# Altium schematic sheet LDO_LD.SchDoc
size A4; SPICEModelCacheCRXGBNIE: <root> / <DocumentId>CRXGBNIE</DocumentId> / <CacheFrame Number="0"> / <Model Name="2510_74438323010_1u" Kind="CKT"> / <Text>******* / .subckt 2510_74438323010_1u 1 2 / Rp 1 2 2155.33 / Cp 1 2 3.992p / Rs 1 N3 0.063 / L1 N3 2 1.01u / .ends 2510_74438323010_1u</Text> / </Model> / </CacheFrame> / </root>
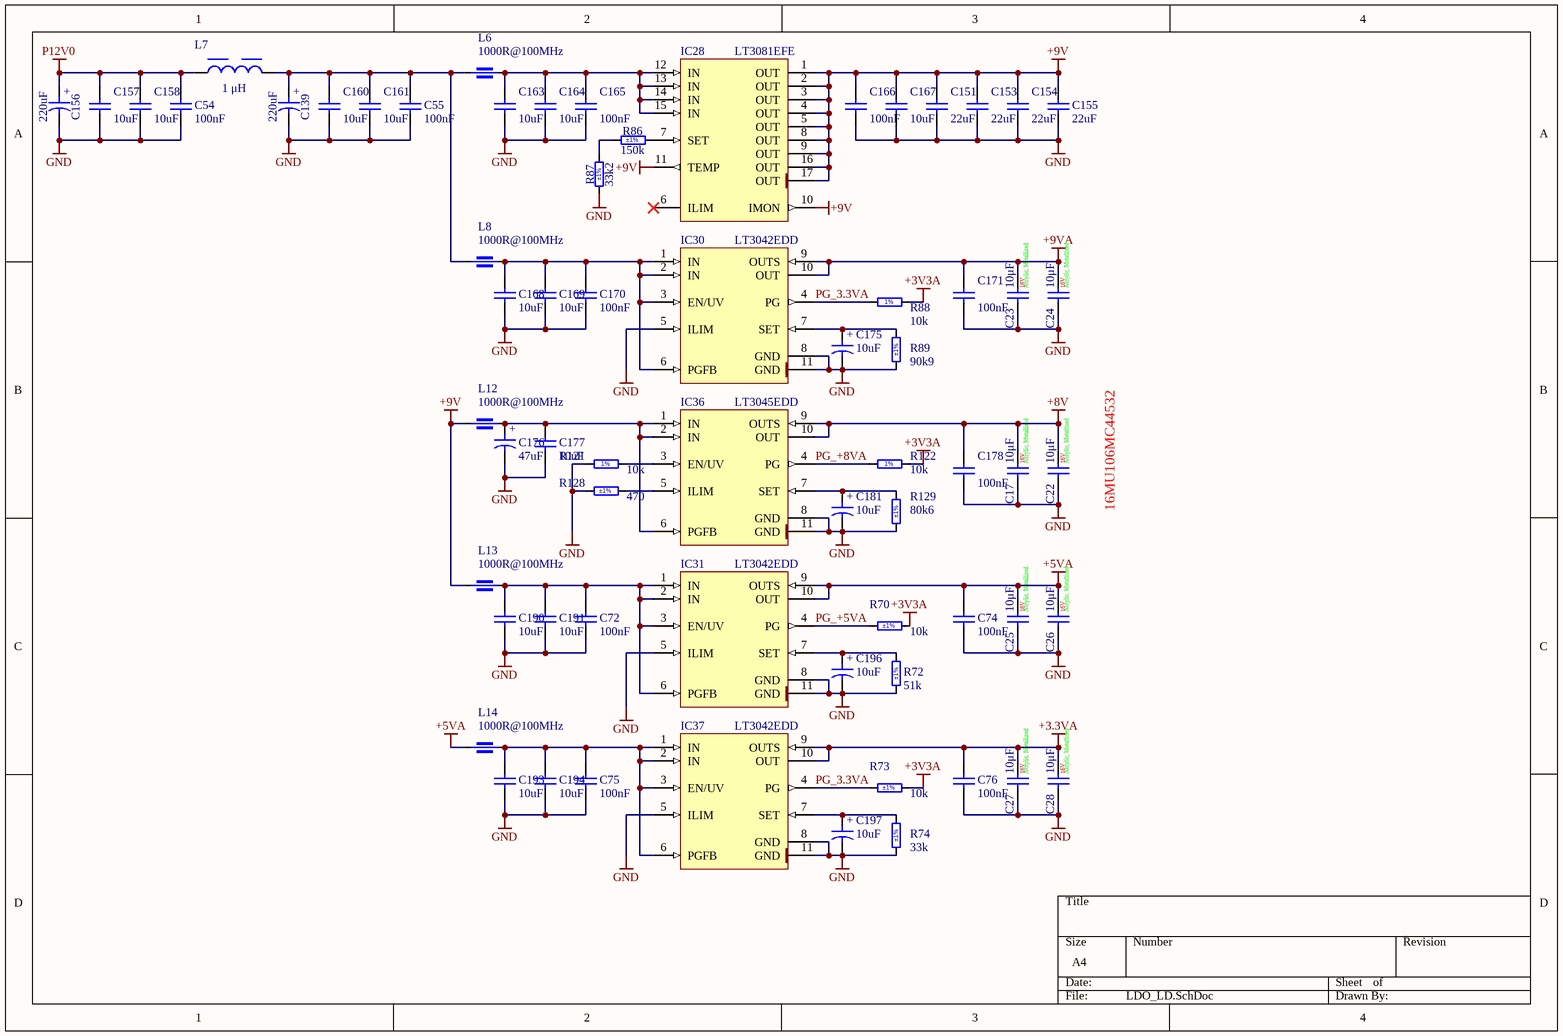
[diagram p0: LDO_LD.SchDoc]

## Parts
C17  DielectrikType: Acrylic, Metallized  Value1: 10μF  Value2: 16V  [16MU106MC44532]  (hidden comment: 16MU106MC44532)
C22  DielectrikType: Acrylic, Metallized  Value1: 10μF  Value2: 16V  [16MU106MC44532]  (hidden comment: 16MU106MC44532)
C23  DielectrikType: Acrylic, Metallized  Value1: 10μF  Value2: 16V  [16MU106MC44532]  (hidden comment: 16MU106MC44532)
C24  DielectrikType: Acrylic, Metallized  Value1: 10μF  Value2: 16V  [16MU106MC44532]  (hidden comment: 16MU106MC44532)
C25  DielectrikType: Acrylic, Metallized  Value1: 10μF  Value2: 16V  [16MU106MC44532]  (hidden comment: 16MU106MC44532)
C26  DielectrikType: Acrylic, Metallized  Value1: 10μF  Value2: 16V  [16MU106MC44532]  (hidden comment: 16MU106MC44532)
C27  DielectrikType: Acrylic, Metallized  Value1: 10μF  Value2: 16V  [16MU106MC44532]  (hidden comment: 16MU106MC44532)
C28  DielectrikType: Acrylic, Metallized  Value1: 10μF  Value2: 16V  [16MU106MC44532]  (hidden comment: 16MU106MC44532)
C54  100nF  [CAPC1005X55N]
C55  100nF  [CAPC1005X55N]
C72  100nF  [CAPC1005X55N]
C74  100nF  [CAPC1005X55N]
C75  100nF  [CAPC1005X55N]
C76  100nF  [CAPC1005X55N]
C139  220uF  [CAPMP7343X430N]
C151  22uF  [CAPC3216X180N]
C153  22uF  [CAPC3216X180N]
C154  22uF  [CAPC3216X180N]
C155  22uF  [CAPC3216X180N]
C156  220uF  [CAPMP7343X430N]
C157  10uF  [CAPC2012X145N]
C158  10uF  [CAPC2012X145N]
C160  10uF  [CAPC2012X145N]
C161  10uF  [CAPC2012X145N]
C163  10uF  [CAPC2012X145N]
C164  10uF  [CAPC2012X145N]
C165  100nF  [CAPC1005X55N]
C166  100nF  [CAPC1005X55N]
C167  10uF  [CAPC2012X145N]
C168  10uF  [CAPC2012X145N]
C169  10uF  [CAPC2012X145N]
C170  100nF  [CAPC1005X55N]
C171  100nF  [CAPC1005X55N]
C175  10uF  [CAPMP6032X280N]
C176  47uF  [CAPMP6032X280N]
C177  10uF  [CAPC2012X145N]
C178  100nF  [CAPC1005X55N]
C181  10uF  [CAPMP6032X280N]
C190  10uF  [CAPC2012X145N]
C191  10uF  [CAPC2012X145N]
C193  10uF  [CAPC2012X145N]
C194  10uF  [CAPC2012X145N]
C196  10uF  [CAPMP6032X280N]
C197  10uF  [CAPMP6032X280N]
IC28  LT3081EFE  [SOP65P640X110-17N-R294X358]
IC30  LT3042EDD  [SON50P300X300X80-11N-R175X248]
IC31  LT3042EDD  [SON50P300X300X80-11N-R175X248]
IC36  LT3045EDD  [SON50P300X300X80-11N-R175X248]
IC37  LT3042EDD  [SON50P300X300X80-11N-R175X248]
L6  1000R@100MHz  [INDC1608X95N]
L7  1 μH  [WE-MAPI_2510]
L8  1000R@100MHz  [INDC1608X95N]
L12  1000R@100MHz  [INDC1608X95N]
L13  1000R@100MHz  [INDC1608X95N]
L14  1000R@100MHz  [INDC1608X95N]
R70  10k  Tolerance: ±1%  [RESC1005X40N]
R72  51k  Tolerance: ±1%  [RESC1005X40N]
R73  10k  Tolerance: ±1%  [RESC1005X40N]
R74  33k  Tolerance: ±1%  [RESC1005X40N]
R86  150k  Tolerance: ±1%  [RESC1608X55N]
R87  33k2  Tolerance: ±1%  [RESC1608X55N]
R88  10k  [RESC1005X40N]
R89  90k9  Tolerance: ±1%  [RESC1608X55N]
R121  10k  [RESC1005X40N]
R122  10k  [RESC1005X40N]
R128  470  Tolerance: ±1%  [RESC1608X55N]
R129  80k6  Tolerance: ±1%  [RESC1608X55N]

## Nets
+3.3VA: C27.2 C28.2 C76.1 IC37.9(OUTS) IC37.10(OUT)
+3V3A: R70.2 R73.2 R88.2 R122.2
+5VA: C25.2 C26.2 C74.1 IC31.9(OUTS) IC31.10(OUT) L14.1
+8V: C17.2 C22.2 C178.1 IC36.9(OUTS) IC36.10(OUT)
+9V: C151.2 C153.2 C154.2 C155.2 C166.1 C167.2 IC28.1(OUT) IC28.2(OUT) IC28.3(OUT) IC28.4(OUT) IC28.5(OUT) IC28.8(OUT) IC28.9(OUT) IC28.10(IMON) IC28.11(TEMP) IC28.16(OUT) IC28.17(OUT) L12.1 L13.1
+9VA: C23.2 C24.2 C171.1 IC30.9(OUTS) IC30.10(OUT)
GND: C17.1 C22.1 C23.1 C24.1 C25.1 C26.1 C27.1 C28.1 C54.2 C55.2 C72.2 C74.2 C75.2 C76.2 C139.2 C151.1 C153.1 C154.1 C155.1 C156.2 C157.1 C158.1 C160.1 C161.1 C163.1 C164.1 C165.2 C166.2 C167.1 C168.1 C169.1 C170.2 C171.2 C175.2 C176.2 C177.1 C178.2 C181.2 C190.1 C191.1 C193.1 C194.1 C196.2 C197.2 IC30.5(ILIM) IC30.8(GND) IC30.11(GND) IC31.5(ILIM) IC31.8(GND) IC31.11(GND) IC36.8(GND) IC36.11(GND) IC37.5(ILIM) IC37.8(GND) IC37.11(GND) R72.1 R74.1 R87.1 R89.1 R121.1 R128.1 R129.1
P12V0: C54.1 C156.1 C157.2 C158.2 L7.1
PG_3.3VA: IC30.4(PG) IC37.4(PG) R73.1 R88.1
PG_+5VA: IC31.4(PG) R70.1
PG_+8VA: IC36.4(PG) R122.1
NetC55_1: C55.1 C139.1 C160.2 C161.2 L6.1 L7.2 L8.1
NetC72_1: C72.1 C190.2 C191.2 IC31.1(IN) IC31.2(IN) IC31.3(EN/UV) IC31.6(PGFB) L13.2
NetC75_1: C75.1 C193.2 C194.2 IC37.1(IN) IC37.2(IN) IC37.3(EN/UV) IC37.6(PGFB) L14.2
NetC163_2: C163.2 C164.2 C165.1 IC28.12(IN) IC28.13(IN) IC28.14(IN) IC28.15(IN) L6.2
NetC168_2: C168.2 C169.2 C170.1 IC30.1(IN) IC30.2(IN) IC30.3(EN/UV) IC30.6(PGFB) L8.2
NetC175_1: C175.1 IC30.7(SET) R89.2
NetC176_1: C176.1 C177.2 IC36.1(IN) IC36.2(IN) IC36.6(PGFB) L12.2
NetC181_1: C181.1 IC36.7(SET) R129.2
NetC196_1: C196.1 IC31.7(SET) R72.2
NetC197_1: C197.1 IC37.7(SET) R74.2
NetIC28_7: IC28.7(SET) R86.2
NetIC36_3: IC36.3(EN/UV) R121.2
NetIC36_5: IC36.5(ILIM) R128.2
NetR86_1: R86.1 R87.2

Not connected (* = marked no-connect by the designer): IC28 6(ILIM)*

## Notes on the sheet
- (near C22) 16MU106MC44532
- (in symbol CTE6032-28_10UF_25V_10%_LESR0500) +
- (in symbol CTE6032-28_47UF_16V_10%_LESR0350) +
- (in symbol CTE7343-43_220UF_16V_10%) +
- (in symbol R0402_10K_1%_0.0625W_100PPM) 1%

## Library data of the parts
C17 C22-C28 = 10uF/16V/1812/MET: 10 µF Film Capacitor 16V Acrylic, Metallized 1812 (4532 Metric); Manufacture: Rubycon; Shop1ID: 1189-2511-2-ND; DafaultFootprint: 1812; Assembly: SMD; Parameter1: Cap; Parameter2: Vr; Tolerance1: ±20%; Shop1: Digi-Key; ComponentLink1URL: https://www.rubycon.co.jp/wp-content/uploads/catalog-pmlcap/MU.pdf; ComponentLink2URL: *; ComponentLink1Description: Datasheet; ComponentLink2Description: *; ComponentType: Capacitor; ComponentSymbol: 16MU106MC44532; Parameter3: *; Tolerance2: *
C54 C55 C72 C74-C76 C165 C166 C170 C171 C178 = CC0402_100NF_16V_10%_X5R: Non-polarised capacitor; Part Description: SMD Multilayer Chip Ceramic Capacitor; Manufacturer: GENERIC; Manufacturer1 Part Number: GRM155R61C104KA88D; Voltage: 16V; TC: X5R; Tolerance: ±10%; Table: Capacitors SMD; Part Number: CC0402_100NF_16V_10%_X5R; Component Kind: Standard; Component Type: Standard; Pin Count: 2; Value: 100nF; Status: None; Manufacturer Part Number: CC0402_100NF_16V_10%_X5R; Case: 0402; Mounted: Yes; Socket: No; SMD: Yes; Manufacturer1 Example: MURATA; Manufacturer1 ComponentHeight: 0.55mm; HelpURL: \\cern.ch\dfs\Applications\Altium\Datasheets\CC0402_X5R_MURATA_GRM.pdf; Author: CERN DEM JLC; CreateDate: 2013-12-10; LatestRevisionDate: 2013-12-10
C139 C156 = CTE7343-43_220UF_16V_10%: Polarised capacitor; Part Description: Solid Tantalum Chip Capacitor; Manufacturer: GENERIC; Manufacturer1 Part Number: TAJE227K016R; Voltage: 16V; Tolerance: ±10%; Part Number: CTE7343-43_220UF_16V_10%; Component Kind: Standard; Component Type: Standard; Pin Count: 2; Value: 220uF; Status: Preferred; Manufacturer Part Number: CTE7343-43_220UF_16V_10%; Case: E; Mounted: Yes; Socket: No; SMD: Yes; Sense: No; Manufacturer1 Example: AVX; Manufacturer1 ComponentHeight: 4.3mm; HelpURL: \\cern.ch\dfs\Applications\Altium\Datasheets\CTE_AVX_TAJ.pdf; Author: CERN DEM JLC; CreateDate: 03.12.2007; LatestRevisionDate: 03.12.2007
C151 C153-C155 = CC1206_22UF_10V_10%_X7R: Non-polarised capacitor; Part Description: SMD Multilayer Chip Ceramic Capacitor; Manufacturer: GENERIC; Manufacturer1 Part Number: GRM31CR71A226KE15L; Voltage: 10V; TC: X7R; Tolerance: ±10%; Part Number: CC1206_22UF_10V_10%_X7R; Component Kind: Standard; Component Type: Standard; Pin Count: 2; Value: 22uF; Status: Preferred; Manufacturer Part Number: CC1206_22UF_10V_10%_X7R; Case: 1206; Mounted: Yes; Socket: No; SMD: Yes; Sense: No; Manufacturer1 Example: MURATA; Manufacturer1 ComponentHeight: 1.8mm; HelpURL: \\cern.ch\dfs\Applications\Altium\Datasheets\CC1206_X7R_MURATA_GRM-HI-CAP.pdf; Author: CERN DEM JLC; CreateDate: 08.06.2010; LatestRevisionDate: 08.06.2010
C157 C158 C160 C161 C163 C164 C167-C169 C177 C190 C191 C193 C194 = CC0805_10UF_25V_10%_X7R: Non-polarised capacitor; Part Description: SMD Multilayer Chip Ceramic Capacitor; Manufacturer: GENERIC; Manufacturer1 Part Number: GRM21BZ71E106KE15; Voltage: 25V; TC: X7R; Tolerance: ±10%; Part Number: CC0805_10UF_25V_10%_X7R; Component Kind: Standard; Component Type: Standard; Pin Count: 2; Value: 10uF; Status: Preferred; Manufacturer Part Number: CC0805_10UF_25V_10%_X7R; Case: 0805; Mounted: Yes; Socket: No; SMD: Yes; Sense: No; Manufacturer1 Example: MURATA; Manufacturer1 ComponentHeight: 1.45mm; HelpURL: \\cern.ch\dfs\Applications\Altium\Datasheets\CC0805_MURATA_GRM21BZ71E106KE15.pdf; Author: CERN DEM HF; CreateDate: 16.05.2023; LatestRevisionDate: 16.05.2023
C175 C181 C196 C197 = CTE6032-28_10UF_25V_10%_LESR0500: Polarised capacitor; Part Description: Low ESR 0R5 Solid Tantalum Chip Capacitor; Manufacturer: GENERIC; Manufacturer1 Part Number: TPSC106K025R0500; Voltage: 25V; Tolerance: ±10%; Part Number: CTE6032-28_10UF_25V_10%_LESR0500; Component Kind: Standard; Component Type: Standard; Pin Count: 2; Value: 10uF; Status: Preferred; Manufacturer Part Number: CTE6032-28_10UF_25V_10%_LESR0500; Case: C; Mounted: Yes; Socket: No; SMD: Yes; Sense: No; Manufacturer1 Example: AVX; Manufacturer1 ComponentHeight: 2.8mm; HelpURL: \\cern.ch\dfs\Applications\Altium\Datasheets\CTE-LESR_AVX_TPS.pdf; Author: CERN DEM JLC; CreateDate: 05.05.2008; LatestRevisionDate: 20.01.2009
C176 = CTE6032-28_47UF_16V_10%_LESR0350: Polarised capacitor; Part Description: Low ESR 0R350 Solid Tantalum Chip Capacitor; Manufacturer: GENERIC; Manufacturer1 Part Number: TPSC476K016R0350; Voltage: 16V; Tolerance: ±10%; Part Number: CTE6032-28_47UF_16V_10%_LESR0350; Component Kind: Standard; Component Type: Standard; Pin Count: 2; Value: 47uF; Status: Preferred; Manufacturer Part Number: CTE6032-28_47UF_16V_10%_LESR0350; Case: C; Mounted: Yes; Socket: No; SMD: Yes; Sense: No; Manufacturer1 Example: AVX; Manufacturer1 ComponentHeight: 2.8mm; HelpURL: \\cern.ch\dfs\Applications\Altium\Datasheets\CTE-LESR_AVX_TPS.pdf; Author: CERN DEM JLC; CreateDate: 05.05.2008; LatestRevisionDate: 20.01.2009
IC28 = LT3081EFE#PBF: 1.2 To 36V, 1.5A Single Resistor Rugged Linear Regulator With Monitors; Manufacturer: LINEAR TECHNOLOGY; PressFit: No; Bonding: No; Part Number: LT3081EFE#PBF; Component Kind: Standard; Component Type: Standard; Device: LT3081EFE; PackageDescription: SOP, 0.65mm Pitch; 16 Pin, 4.40mm W X 5.00mm L X 1.10mm H body (w/thermal tab 2.94mm X 3.58mm), IPC Medium Density; Part Description: 1.2 To 36V, 1.5A Single Resistor Rugged Linear Regulator with Monitors; Manufacturer Part Number: LT3081EFE; Pin Count: 17; Case: TSSOP16; Mounted: Yes; Socket: No; SMD: Yes; Sense: No; ComponentHeight: 1.1mm; HelpURL: \\cern.ch\dfs\Applications\Altium\Datasheets\LT3081EFE#PBF.pdf; Author: CERN DEM MR; CreateDate: 05.10.2016; LatestRevisionDate: 03.02.2022
IC30 IC31 IC37 = LT3042EDD: 20V, 200mA, Ultralow Noise, Ultrahigh PSRR RF Linear Regulator; Manufacturer: ANALOG DEVICES; PressFit: No; Bonding: No; Part Number: LT3042EDD; Component Kind: Standard; Component Type: Standard; Device: LT3042EDD; PackageDescription: SON, 0.50mm Pitch; 10 Pin, 3.00mm W X 3.00mm L X 0.80mm H body (w/Thermal Tab 1.75 X 2.48 mm), IPC Medium Density; Part Description: 20V, 200mA, Ultralow Noise, Ultrahigh PSRR RF Linear Regulator; Manufacturer Part Number: LT3042EDD; Pin Count: 11; Case: SON10; Mounted: Yes; Socket: No; SMD: Yes; Sense: No; ComponentHeight: 0.8mm; HelpURL: \\cern.ch\dfs\Applications\Altium\Datasheets\LT3042.pdf; Author: CERN DEM HF; CreateDate: 27.04.2022; LatestRevisionDate: 27.04.2022
IC36 = LT3045EDD#PBF: 20V, 500mA, Ultralow Noise, Ultrahigh PSRR Linear Regulator; Manufacturer: LINEAR TECHNOLOGY; PressFit: No; Bonding: No; Part Number: LT3045EDD#PBF; Component Kind: Standard; Component Type: Standard; Device: LT3045EDD; PackageDescription: SON, 0.50mm Pitch; 10 Pin, 3.00mm W X 3.00mm L X 0.80mm H body (w/Thermal Tab 1.75 X 2.48 mm), IPC Medium Density; Part Description: 20V, 500mA, Ultralow Noise, Ultrahigh PSRR Linear Regulator; Manufacturer Part Number: LT3045EDD; Pin Count: 11; Case: SON10; Mounted: Yes; Socket: No; SMD: Yes; Sense: No; ComponentHeight: 0.8mm; HelpURL: \\cern.ch\dfs\Applications\Altium\Datasheets\LT3045EDD#PBF.pdf; Author: CERN DEM JLC; CreateDate: 07.12.2016; LatestRevisionDate: 03.02.2022
L6 L8 L12-L14 = IND0603_MURATA_BLM18KG102SN1: Part Description: SMD Chip Ferrite Bead, Automotive; Manufacturer: MURATA; Manufacturer Part Number: BLM18KG102WH1; Power: 1A; Resistance: 0.2R; Tolerance: ±25%; Part Number: IND0603_MURATA_BLM18KG102SN1; Component Kind: Standard; Component Type: Standard; Pin Count: 2; Value: 1000R@100MHz; Case: 0603; Mounted: Yes; Socket: No; SMD: Yes; Sense: No; ComponentHeight: 0.95mm; HelpURL: \\cern.ch\dfs\Applications\Altium\Datasheets\IND0603_MURATA_BLM18KG102SN1.pdf; Author: CERN DEM HF; CreateDate: 15.12.2022; LatestRevisionDate: 15.12.2022
L7 = 74438323010: WE-MAPI SMT Power Inductor, size 2510, 1 μH, 3.55 A, 63 mΩ; Manufacturer: Wurth Elektronik; Case/Size Code: 2510; DC Resistance: 63 mΩ; Operating Voltage (DC): 80 V; Performance Rated Current: 3.55 A; Saturation Current @ 30%: 5.3 A; Self Resonant Frequency: 80 MHz; Manufacturer Part Number: 74438323010; Category: Power Inductors; Match Code: WE-MAPI; ComponentLink1Description: Website Link; ComponentLink1URL: https://www.we-online.com/redexpert/article/74438323010?ad; ComponentLink2Description: Datasheet Link; ComponentLink2URL: https://www.we-online.com/redexpert/spec/74438323010?ad; Mount: Surface Mount; Min Operating Temperature: -40 °C; Max Operating Temperature: 125 °C; Packaging: Tape and Reel; Length: 2.5 mm; Width: 2 mm; Height: 1 mm; Inductance: 1 μH
R70 R73 R88 R121 R122 = R0402_10K_1%_0.0625W_100PPM: Resistor - 1%; Part Description: General Purpose Thick Film Chip Resistor; Manufacturer: GENERIC; Manufacturer1 Part Number: 232270671003L; TC: ±100ppm/°C; PressFit: No; Part Number: R0402_10K_1%_0.0625W_100PPM; Component Kind: Standard; Component Type: Standard; Pin Count: 2; Value: 10k; Status: Not Recommended; Power: 0.0625W; Manufacturer Part Number: R0402_10K_1%_0.0625W_100PPM; Case: 0402; Mounted: Yes; Sense: No; Socket: No; SMD: Yes; Manufacturer1 Example: YAGEO PHYCOMP; Manufacturer1 ComponentHeight: 0.4mm; HelpURL: \\cern.ch\dfs\Applications\Altium\Datasheets\R0402_Phycomp_RC0402.pdf; Author: CERN DEM JLC
  R70 R73: CreateDate: 03.12.2007; LatestRevisionDate: 17.10.2012
  R88 R121 R122: Tolerance: ±1%; CreateDate: 03/12/2007; LatestRevisionDate: 17/10/2012
R72 = R0402_51K_1%_0.0625W_100PPM: Resistor - 1%; Part Description: General Purpose Thick Film Chip Resistor; Manufacturer: GENERIC; Manufacturer1 Part Number: 232270675103L; TC: ±100ppm/°C; PressFit: No; Part Number: R0402_51K_1%_0.0625W_100PPM; Component Kind: Standard; Component Type: Standard; Pin Count: 2; Value: 51k; Status: Not Recommended; Power: 0.0625W; Manufacturer Part Number: R0402_51K_1%_0.0625W_100PPM; Case: 0402; Mounted: Yes; Sense: No; Socket: No; SMD: Yes; Manufacturer1 Example: YAGEO PHYCOMP; Manufacturer1 ComponentHeight: 0.4mm; HelpURL: \\cern.ch\dfs\Applications\Altium\Datasheets\R0402_Phycomp_RC0402.pdf; Author: CERN DEM JLC; CreateDate: 03.12.2007; LatestRevisionDate: 17.10.2012
R74 = R0402_33K_1%_0.0625W_100PPM: Resistor - 1%; Part Description: General Purpose Thick Film Chip Resistor; Manufacturer: GENERIC; Manufacturer1 Part Number: 232270673303L; TC: ±100ppm/°C; PressFit: No; Part Number: R0402_33K_1%_0.0625W_100PPM; Component Kind: Standard; Component Type: Standard; Pin Count: 2; Value: 33k; Status: Not Recommended; Power: 0.0625W; Manufacturer Part Number: R0402_33K_1%_0.0625W_100PPM; Case: 0402; Mounted: Yes; Sense: No; Socket: No; SMD: Yes; Manufacturer1 Example: YAGEO PHYCOMP; Manufacturer1 ComponentHeight: 0.4mm; HelpURL: \\cern.ch\dfs\Applications\Altium\Datasheets\R0402_Phycomp_RC0402.pdf; Author: CERN DEM JLC; CreateDate: 03.12.2007; LatestRevisionDate: 17.10.2012
R86 = R0603_150K_1%_0.1W_100PPM: Resistor - 1%; Part Description: General Purpose Thick Film Chip Resistor; Manufacturer: GENERIC; Manufacturer1 Part Number: NRC06F1503TRF; Power: 0.1W; TC: ±100ppm/°C; PressFit: No; Part Number: R0603_150K_1%_0.1W_100PPM; Component Kind: Standard; Component Type: Standard; Pin Count: 2; Value: 150k; Status: Preferred; Manufacturer Part Number: R0603_150K_1%_0.1W_100PPM; Case: 0603; Mounted: Yes; Sense: No; Socket: No; SMD: Yes; Manufacturer1 Example: NIC COMPONENT; Manufacturer1 ComponentHeight: 0.55mm; HelpURL: \\cern.ch\dfs\Applications\Altium\Datasheets\R0603_NIC_NRC.pdf; Author: CERN DEM JLC; CreateDate: 03.12.2007; LatestRevisionDate: 13.03.2008
R87 = R0603_33K2_1%_0.1W_100PPM: Resistor - 1%; Part Description: General Purpose Thick Film Chip Resistor; Manufacturer: GENERIC; Manufacturer1 Part Number: CRCW060333K2FKEA; Power: 0.1W; TC: ±100ppm/°C; PressFit: No; Part Number: R0603_33K2_1%_0.1W_100PPM; Component Kind: Standard; Component Type: Standard; Pin Count: 2; Value: 33k2; Status: Preferred; Manufacturer Part Number: R0603_33K2_1%_0.1W_100PPM; Case: 0603; Mounted: Yes; Sense: No; Socket: No; SMD: Yes; Manufacturer1 Example: VISHAY; Manufacturer1 ComponentHeight: 0.55mm; HelpURL: \\cern.ch\dfs\Applications\Altium\Datasheets\R0603_VISHAY_CRCW e3.pdf; Author: CERN DEM JLC; CreateDate: 14.03.2018; LatestRevisionDate: 14.03.2018
R89 = R0603_90K9_1%_0.1W_100PPM: Resistor - 1%; Part Description: General Purpose Thick Film Chip Resistor; Manufacturer: GENERIC; Manufacturer1 Part Number: CRCW060390K9FKEA; Power: 0.1W; TC: ±100ppm/°C; PressFit: No; Part Number: R0603_90K9_1%_0.1W_100PPM; Component Kind: Standard; Component Type: Standard; Pin Count: 2; Value: 90k9; Status: Preferred; Manufacturer Part Number: R0603_90K9_1%_0.1W_100PPM; Case: 0603; Mounted: Yes; Sense: No; Socket: No; SMD: Yes; Manufacturer1 Example: VISHAY; Manufacturer1 ComponentHeight: 0.55mm; HelpURL: \\cern.ch\dfs\Applications\Altium\Datasheets\R0603_VISHAY_CRCW e3.pdf; Author: CERN DEM JLC; CreateDate: 14.03.2018; LatestRevisionDate: 14.03.2018
R128 = R0603_470R_1%_0.1W_100PPM: Resistor - 1%; Part Description: General Purpose Thick Film Chip Resistor; Manufacturer: GENERIC; Manufacturer1 Part Number: NRC06F4700TRF; Power: 0.1W; TC: ±100ppm/°C; PressFit: No; Part Number: R0603_470R_1%_0.1W_100PPM; Component Kind: Standard; Component Type: Standard; Pin Count: 2; Value: 470; Status: Preferred; Manufacturer Part Number: R0603_470R_1%_0.1W_100PPM; Case: 0603; Mounted: Yes; Sense: No; Socket: No; SMD: Yes; Manufacturer1 Example: NIC COMPONENT; Manufacturer1 ComponentHeight: 0.55mm; HelpURL: \\cern.ch\dfs\Applications\Altium\Datasheets\R0603_NIC_NRC.pdf; Author: CERN DEM JLC; CreateDate: 03.12.2007; LatestRevisionDate: 13.03.2008
R129 = R0603_80k6_1%_0.1W_100PPM_BOURNS_CR0603: Resistor - 1%; Part Description: Pulse Resistant Power Thick Film Chip Resistor; Manufacturer: BOURNS; Manufacturer Part Number: CR0603-FX-8062; Power: 0.1W; TC: ±100ppm/°C; PressFit: No; Part Number: R0603_80k6_1%_0.1W_100PPM_BOURNS_CR0603; Component Kind: Standard; Component Type: Standard; Pin Count: 2; Value: 80k6; Status: None; Case: 0603; Mounted: Yes; Sense: No; Socket: No; SMD: Yes; ComponentHeight: 0.55mm; HelpURL: \\cern.ch\dfs\Applications\Altium\Datasheets\R0603_BOURNS_CR0603.pdf; Author: CERN DEM HF; CreateDate: 18.03.2022; LatestRevisionDate: 18.03.2022